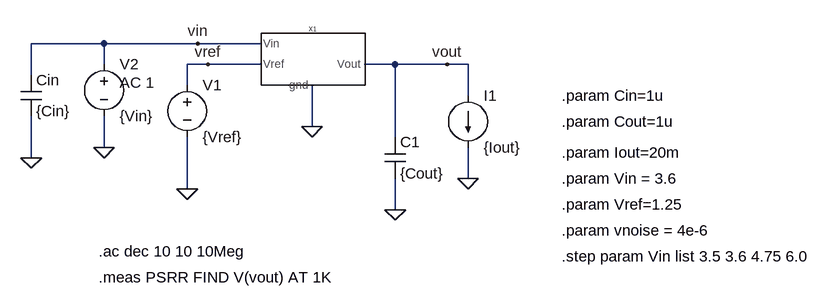
[diagram p0: schematic PSRR_6p34.asc]
PSRR_6p34.asc, the LTspice schematic file:
Version 4
SHEET 1 992 680
WIRE -128 96 -240 96
WIRE 16 96 -128 96
WIRE 112 96 16 96
WIRE -128 128 -128 96
WIRE 32 128 0 128
WIRE 112 128 32 128
WIRE 320 128 272 128
WIRE 400 128 320 128
WIRE 432 128 400 128
WIRE -240 144 -240 96
WIRE 0 160 0 128
WIRE 432 176 432 128
WIRE 192 224 192 160
WIRE 320 240 320 128
WIRE -128 256 -128 208
WIRE -240 272 -240 208
WIRE 432 304 432 256
WIRE 0 320 0 240
WIRE 320 352 320 304
FLAG 32 128 vref
FLAG -128 256 0
FLAG 16 96 vin
FLAG 320 352 0
FLAG 432 304 0
FLAG 400 128 vout
FLAG 192 224 0
FLAG -240 272 0
FLAG 0 320 0
SYMBOL LDO_basic 192 112 R0
SYMATTR InstName X1
SYMBOL voltage 0 144 R0
WINDOW 123 0 0 Left 0
WINDOW 39 0 0 Left 0
SYMATTR InstName V1
SYMATTR Value {Vref}
SYMBOL voltage -128 112 R0
WINDOW 123 24 44 Left 2
WINDOW 39 0 0 Left 0
SYMATTR Value2 AC 1
SYMATTR InstName V2
SYMATTR Value {Vin}
SYMBOL cap 304 240 R0
SYMATTR InstName C1
SYMATTR Value {Cout}
SYMBOL current 432 176 R0
WINDOW 123 0 0 Left 0
WINDOW 39 0 0 Left 0
SYMATTR InstName I1
SYMATTR Value {Iout}
SYMBOL cap -256 144 R0
SYMATTR InstName Cin
SYMATTR Value {Cin}
TEXT -136 416 Left 2 !.ac dec 10 10 10Meg
TEXT 576 264 Left 2 !.param Iout=20m
TEXT 576 216 Left 2 !.param Cout=1u
TEXT 576 176 Left 2 !.param Cin=1u
TEXT 576 304 Left 2 !.param Vin = 3.6
TEXT 576 344 Left 2 !.param Vref=1.25
TEXT 576 384 Left 2 !.param vnoise = 4e-6
TEXT 576 424 Left 2 !.step param Vin list 3.5 3.6 4.75 6.0
TEXT -136 456 Left 2 !.meas PSRR FIND V(vout) AT 1K

The netlist it stands for:
* PSRR_6p34.asc
XX1 vin vref 0 vout LDO_basic  ; pins Vin Vref gnd Vout
V1 vref 0 {Vref}
V2 vin 0 {Vin} AC 1
C1 vout 0 {Cout}
I1 vout 0 {Iout}
Cin vin 0 {Cin}
.ac dec 10 10 10Meg
.param Iout=20m
.param Cout=1u
.param Cin=1u
.param Vin = 3.6
.param Vref=1.25
.param vnoise = 4e-6
.step param Vin list 3.5 3.6 4.75 6.0
.meas PSRR FIND V(vout) AT 1K
.backanno
.end